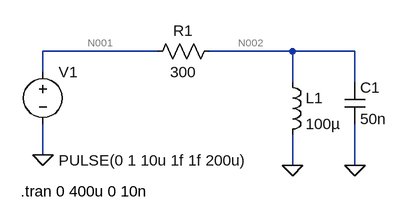
[diagram p0: schematic Цепь_Колебательный_контур.asc]
Цепь_Колебательный_контур.asc, the LTspice schematic file:
Version 4
SHEET 1 880 680
WIRE 80 16 -96 16
WIRE 288 16 160 16
WIRE 384 16 288 16
WIRE -96 48 -96 16
WIRE 288 64 288 16
WIRE 384 64 384 16
WIRE -96 176 -96 128
WIRE 288 192 288 144
WIRE 384 192 384 128
FLAG -96 176 0
FLAG 288 192 0
FLAG 384 192 0
SYMBOL voltage -96 32 R0
WINDOW 3 24 152 Left 2
WINDOW 123 0 0 Left 0
WINDOW 39 24 180 Left 2
SYMATTR InstName V1
SYMATTR Value PULSE(0 1 10u 1f 1f 200u)
SYMBOL res 176 0 R90
WINDOW 0 0 56 VBottom 2
WINDOW 3 32 56 VTop 2
SYMATTR InstName R1
SYMATTR Value 300
SYMBOL ind 272 48 R0
SYMATTR InstName L1
SYMATTR Value 100µ
SYMBOL cap 368 64 R0
SYMATTR InstName C1
SYMATTR Value 50n
TEXT -130 232 Left 2 !.tran 0 400u 0 10n

The netlist it stands for:
* Цепь_Колебательный_контур.asc
V1 N001 0 PULSE(0 1 10u 1f 1f 200u)
R1 N002 N001 300
L1 N002 0 100µ
C1 N002 0 50n
.tran 0 400u 0 10n
.backanno
.end

* Results of the author's LTspice run, read from the files saved beside the schematic
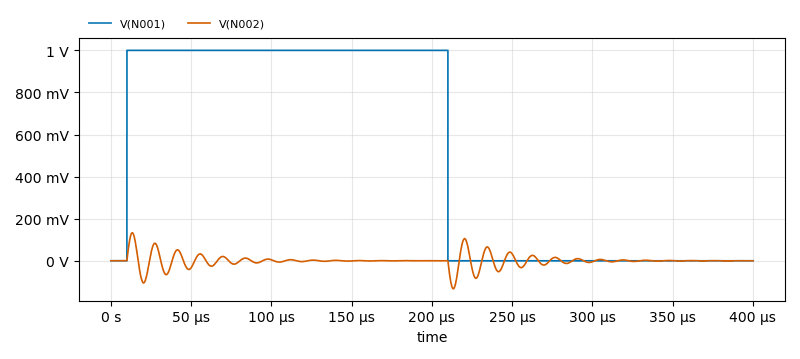
[diagram p1: Transient Analysis of Цепь_Колебательный_контур.asc, plotted from the saved traces]
* Transient Analysis, 1 run:
*   V(N001): min 0 V, max 1 V, average 500 mV, rms 707.1 mV, last 0 V
*   V(N002): min -133.2 mV, max 133.3 mV, average -403.2 nV, rms 28.87 mV, last -23.85 µV